# Altium schematic sheet GNSS.SchDoc
size A4
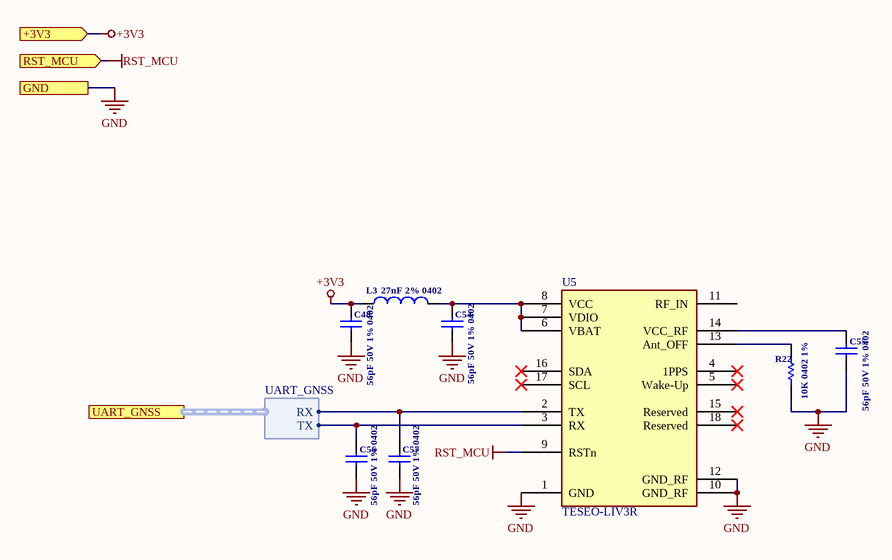
[diagram p0: GNSS.SchDoc]

## Parts
C48  56pF 50V 1% 0402
C54  56pF 50V 1% 0402
C55  56pF 50V 1% 0402
C56  56pF 50V 1% 0402
C57  56pF 50V 1% 0402
L3  27nF 2% 0402
R22  10K 0402 1%  [Resistor_0402]
U5  TESEO-LIV3R

## Ports
+3V3 (in), GND, RST_MCU (in), UART_GNSS (harness UART_GNSS)

## Harnesses
UART_GNSS: RX, TX

## Nets
+3V3: C48.2 L3.1 ; port +3V3
GND: C55.1 C56.1 C57.1 R22.1 U5.1(GND) U5.10(GND_RF) U5.12(GND_RF) ; port GND
RST_MCU: U5.9(RSTn) ; port RST_MCU
NetC54_2: C54.2 L3.2 U5.6(VBAT) U5.7(VDIO) U5.8(VCC)
NetC55_2: C55.2 U5.14(VCC_RF)
NetC56_2: C56.2 U5.3(RX) ; port UART_GNSS.TX
NetC57_2: C57.2 U5.2(TX) ; port UART_GNSS.RX
NetR22_2: R22.2 U5.13(Ant_OFF)

Not connected (* = marked no-connect by the designer): C48 1; C54 1; U5 4(1PPS)* 5(Wake-Up)* 11(RF_IN) 15(Reserved)* 16(SDA)* 17(SCL)* 18(Reserved)*

## Notes on the sheet
- Labels drawn without touching a wire or pin: GND

## Library data of the parts
C48 C54-C57 = CC0402FRNPO9BN560: 56 pF ±1% 50V Ceramic Capacitor C0G, NP0 0402 (1005 Metric); Supplier 1: Digi-Key; Supplier Part Number 1: 311-3734-1-ND; Value: 56pF 50V 1% 0402
L3 = LQG15HS27NG02D: 27 nH Unshielded Multilayer Inductor 350 mA 460mOhm Max 0402 (1005 Metric) -; Supplier 1: Digi-Key; Value: 27nF 2% 0402; Supplier Part Number 1: 490-LQG15HS27NG02DCT-ND
R22 = AC0402FR-0710KL 10K 0402 1%: RES SMD 10K OHM 1% 1/16W 0402; Manufacturer: Yageo; Resistance: 10 kOhms; Power Rating: 62.5 mW (1/16 W); Voltage Rating: 50 V; Temperature Coefficient: 100 PPM / C; Supplier 1: Digi-Key; Manufacturer Part Number: AC0402FR-0710KL; Stock 1: 1375478; Pricing 1: 1=0.1, 10=0.021, 100=0.0086, 1000=0.0039, 2500=0.0033, 5000=0.0028 (USD); Termination Style: SMD/SMT; Product: Thick Film Resistors SMD; Tolerance: 1 %; Case Code - in: 0402; Case Code - mm: 1005; Series: AC; Operating Temperature Range: - 55 C to + 155 C; Packaging: Reel; ComponentLink1URL: http://www.mouser.com/ds/2/447/yageodocoutput-1111992.pdf?src-supplier=Mouser; ComponentLink1Description: http://www.mouser.com/ds/2/447/yageodocoutput-1111992.pdf?src-supplier=Mouser; Supplier Part Number 1: YAG3436CT-ND; Value: 10K 0402 1%
U5 = TESEO-LIV3R: series RF Receiver BeiDou, GLONASS, GNSS, GPS 1.561GHz, 1.575MHz -163dBm - - 18-LCC (9.7x10.1); Supplier 1: Digi-Key; Supplier Part Number 1: 497-19468-1-ND